# Altium schematic sheet UART_TypeC.SchDoc: UART with Type-C USB Interface
size A4; DocumentNumber: 13; SheetNumber: 13; SheetTotal: 16
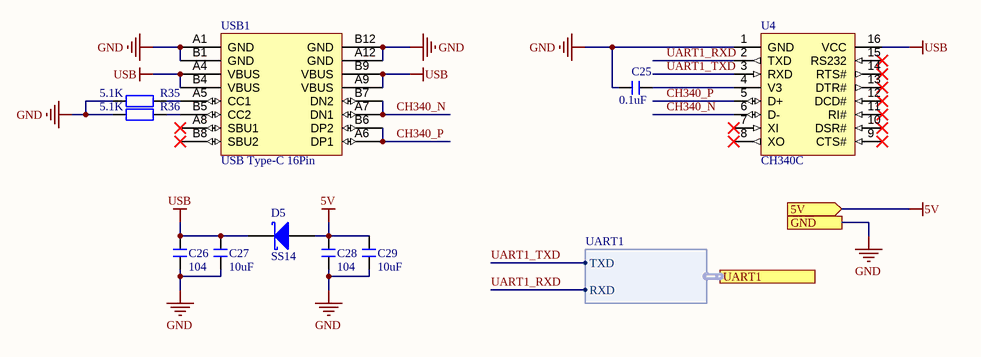
[diagram p0: UART_TypeC.SchDoc]

## Parts
C25  0.1uF  [C 0603_L]
C26  104  [C 0603_L]
C27  10uF  [C 0603_L]
C28  104  [C 0603_L]
C29  10uF  [C 0603_L]
D5  SS14  [SMA]
R35  5.1K  [R 0603_L]
R36  5.1K  [R 0603_L]
U4  CH340C  [SOP16_L]
USB1  USB Type-C 16Pin  [USB-C-SMD-TAILOR]

## Ports
5V (in), GND, UART1 (harness UART1)

## Harnesses
UART1: TXD, RXD

## Nets
5V: C28.2 C29.2 D5.1(A) ; port 5V
GND: C25.1 C26.1 C27.1 C28.1 C29.1 R35.1 R36.1 U4.1(GND) USB1.A1(GND) USB1.A12(GND) USB1.B1(GND) USB1.B12(GND) ; port GND
USB: C26.2 C27.2 D5.2(K) U4.16(VCC) USB1.A4(VBUS) USB1.A9(VBUS) USB1.B4(VBUS) USB1.B9(VBUS)
CH340_N: U4.6(D-) USB1.A7(DN1) USB1.B7(DN2)
CH340_P: U4.5(D+) USB1.A6(DP1) USB1.B6(DP2)
UART1_RXD: U4.2(TXD) ; port UART1.RXD
UART1_TXD: U4.3(RXD) ; port UART1.TXD
NetC25_2: C25.2 U4.4(V3)
NetR35_2: R35.2 USB1.A5(CC1)
NetR36_2: R36.2 USB1.B5(CC2)

Not connected (* = marked no-connect by the designer): U4 7(XI)* 8(XO)* 9(CTS#)* 10(DSR#)* 11(RI#)* 12(DCD#)* 13(DTR#)* 14(RTS#)* 15(RS232)*; USB1 A8(SBU1)* B8(SBU2)*

## Notes on the sheet
- Title
- FileName:
- Version:
- Date:
- Project
- Designed By:
- Descriptions:
- Sheet:
- of

## Library data of the parts
C25-C29 = C: 贴片电容; BOM名称: 无极性贴片电容; 淘宝ID: 封装库来自淘宝 ID：黄晶宝石; 联系售后，技术支持: https://shop463601444.taobao.com; 唯一出售店铺网址: https://shop463601444.taobao.com
D5 = SS14: 肖特基二极管; 属性: 40V/1A; BOM名称: 肖特基二极管; 封装库来自淘宝 ID：黄晶宝石: https://shop463601444.taobao.com
R35 R36 = R: 贴片电阻; 版权归属: 来自淘宝 ID：黄晶宝石; 封装库来自淘宝卖家 ID：黄晶宝石: 其他店铺购入均为盗版，不享受售后技术支持服务，请立即申请退款; BOM名称: 贴片电阻; 联系售后: https://shop463601444.taobao.com
U4 = CH340G: 串口转USB; 版权归属: 封装库来自淘宝 ID：黄晶宝石; BOM名称: 串口转USB; 学习资源: https://shop463601444.taobao.com